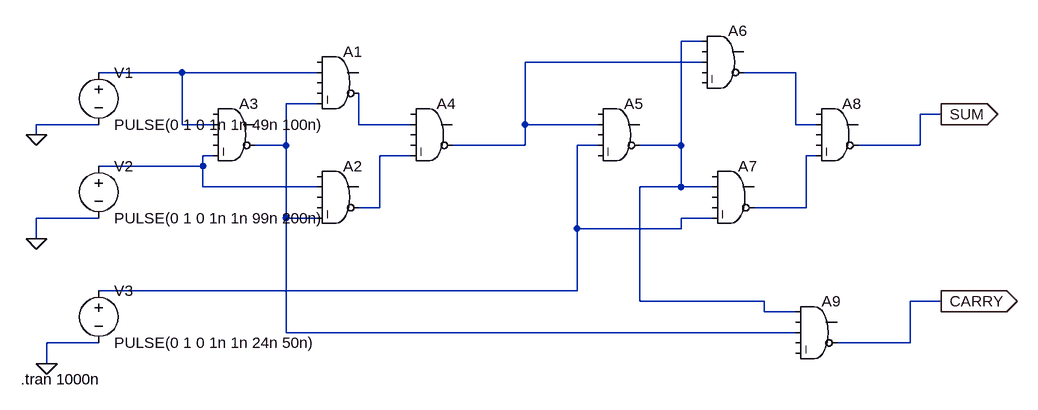
[diagram p0: schematic FA_nand.asc]
FA_nand.asc, the LTspice schematic file:
Version 4
SHEET 1 1084 680
WIRE 576 -16 544 -16
WIRE 576 16 304 16
WIRE -224 32 -352 32
WIRE -16 32 -224 32
WIRE 720 32 640 32
WIRE -16 80 -64 80
WIRE 944 96 912 96
WIRE -352 112 -448 112
WIRE -224 112 -224 32
WIRE -176 112 -224 112
WIRE 48 112 48 64
WIRE 128 112 48 112
WIRE 304 112 304 16
WIRE 416 112 304 112
WIRE 720 112 720 32
WIRE 752 112 720 112
WIRE -448 128 -448 112
WIRE -64 144 -64 80
WIRE -64 144 -112 144
WIRE 304 144 304 112
WIRE 304 144 192 144
WIRE 416 144 384 144
WIRE 544 144 544 -16
WIRE 544 144 480 144
WIRE 912 144 912 96
WIRE 912 144 816 144
WIRE -176 160 -192 160
WIRE 128 160 80 160
WIRE 752 160 736 160
WIRE -192 176 -192 160
WIRE -192 176 -352 176
WIRE -192 208 -192 176
WIRE -16 208 -192 208
WIRE 544 208 544 144
WIRE 544 208 480 208
WIRE 592 208 544 208
WIRE 80 240 80 160
WIRE 80 240 48 240
WIRE 736 240 736 160
WIRE 736 240 656 240
WIRE -352 256 -448 256
WIRE -64 256 -64 144
WIRE -16 256 -64 256
WIRE 592 256 544 256
WIRE 384 272 384 144
WIRE 544 272 544 256
WIRE 544 272 384 272
WIRE -448 288 -448 256
WIRE 384 368 384 272
WIRE 384 368 -352 368
WIRE 480 384 480 208
WIRE 672 384 480 384
WIRE 944 384 896 384
WIRE 672 400 672 384
WIRE 720 400 672 400
WIRE -64 432 -64 256
WIRE 720 432 -64 432
WIRE -352 448 -432 448
WIRE 896 448 896 384
WIRE 896 448 784 448
WIRE -432 480 -432 448
FLAG 944 96 SUM
IOPIN 944 96 Out
FLAG 944 384 CARRY
IOPIN 944 384 Out
FLAG -448 128 0
FLAG -448 288 0
FLAG -432 480 0
SYMBOL Digital\\and 16 -16 R0
SYMATTR InstName A1
SYMBOL Digital\\and 16 160 R0
SYMATTR InstName A2
SYMBOL Digital\\and -144 64 R0
SYMATTR InstName A3
SYMBOL Digital\\and 160 64 R0
SYMATTR InstName A4
SYMBOL Digital\\and 448 64 R0
SYMATTR InstName A5
SYMBOL Digital\\and 608 -48 R0
SYMATTR InstName A6
SYMBOL Digital\\and 624 160 R0
SYMATTR InstName A7
SYMBOL Digital\\and 784 64 R0
SYMATTR InstName A8
SYMBOL Digital\\and 752 368 R0
SYMATTR InstName A9
SYMBOL voltage -352 16 R0
WINDOW 123 0 0 Left 0
WINDOW 39 0 0 Left 0
SYMATTR InstName V1
SYMATTR Value PULSE(0 1 0 1n 1n 49n 100n)
SYMBOL voltage -352 160 R0
WINDOW 123 0 0 Left 0
WINDOW 39 0 0 Left 0
SYMATTR InstName V2
SYMATTR Value PULSE(0 1 0 1n 1n 99n 200n)
SYMBOL voltage -352 352 R0
WINDOW 123 0 0 Left 0
WINDOW 39 0 0 Left 0
SYMATTR InstName V3
SYMATTR Value PULSE(0 1 0 1n 1n 24n 50n)
TEXT -472 504 Left 2 !.tran 1000n

The netlist it stands for:
* FA_nand.asc
A1 0 N003 0 0 N005 N006 0 0 AND
A2 0 N008 0 0 N005 N009 0 0 AND
A3 0 N003 0 0 N008 N005 0 0 AND
A4 0 N006 0 0 N009 N002 0 0 AND
A5 0 N002 0 N007 0 N001 0 0 AND
A6 N001 0 N002 0 0 N004 0 0 AND
A7 0 N001 0 0 N007 N010 0 0 AND
A8 0 N004 0 0 N010 SUM 0 0 AND
A9 N001 0 N005 0 0 CARRY 0 0 AND
V1 N003 0 PULSE(0 1 0 1n 1n 49n 100n)
V2 N008 0 PULSE(0 1 0 1n 1n 99n 200n)
V3 N007 0 PULSE(0 1 0 1n 1n 24n 50n)
.tran 1000n
.backanno
.end